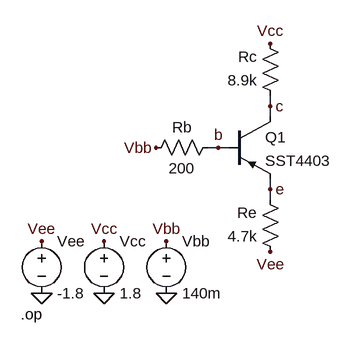
[diagram p0: schematic 24-5-7-b-1-1.asc]
24-5-7-b-1-1.asc, the LTspice schematic file:
Version 4
SHEET 1 880 680
WIRE 512 32 512 16
WIRE 512 48 512 32
WIRE 432 96 416 96
WIRE 448 96 432 96
WIRE 512 160 512 144
WIRE 512 176 512 160
FLAG 160 320 0
FLAG 256 320 0
FLAG 256 240 Vcc
FLAG 160 240 Vee
FLAG 512 32 c
FLAG 432 96 b
FLAG 512 160 e
FLAG 512 -64 Vcc
FLAG 512 256 Vee
FLAG 336 96 Vbb
FLAG 352 320 0
FLAG 352 240 Vbb
SYMBOL voltage 256 224 R0
WINDOW 123 0 0 Left 0
WINDOW 39 0 0 Left 0
SYMATTR InstName Vcc
SYMATTR Value 1.8
SYMBOL voltage 160 224 R0
WINDOW 123 0 0 Left 0
WINDOW 39 0 0 Left 0
SYMATTR InstName Vee
SYMATTR Value -1.8
SYMBOL pnp 448 48 R0
SYMATTR InstName Q1
SYMATTR Value SST4403
SYMBOL res 432 80 R90
WINDOW 0 0 56 VBottom 2
WINDOW 3 32 56 VTop 2
SYMATTR InstName Rb
SYMATTR Value 200
SYMBOL res 528 272 R180
WINDOW 0 36 76 Left 2
WINDOW 3 36 40 Left 2
SYMATTR InstName Re
SYMATTR Value 4.7k
SYMBOL res 528 32 R180
WINDOW 0 36 76 Left 2
WINDOW 3 36 40 Left 2
SYMATTR InstName Rc
SYMATTR Value 8.9k
SYMBOL voltage 352 224 R0
WINDOW 123 0 0 Left 0
WINDOW 39 0 0 Left 0
SYMATTR InstName Vbb
SYMATTR Value 140m
TEXT 128 352 Left 2 !.op

The netlist it stands for:
* 24-5-7-b-1-1.asc
Vcc Vcc 0 1.8
Vee Vee 0 -1.8
Q1 c b e 0 SST4403
Rb b Vbb 200
Re Vee e 4.7k
Rc c Vcc 8.9k
Vbb Vbb 0 140m
.model NPN NPN
.model PNP PNP
.lib standard.bjt
.op
.backanno
.end